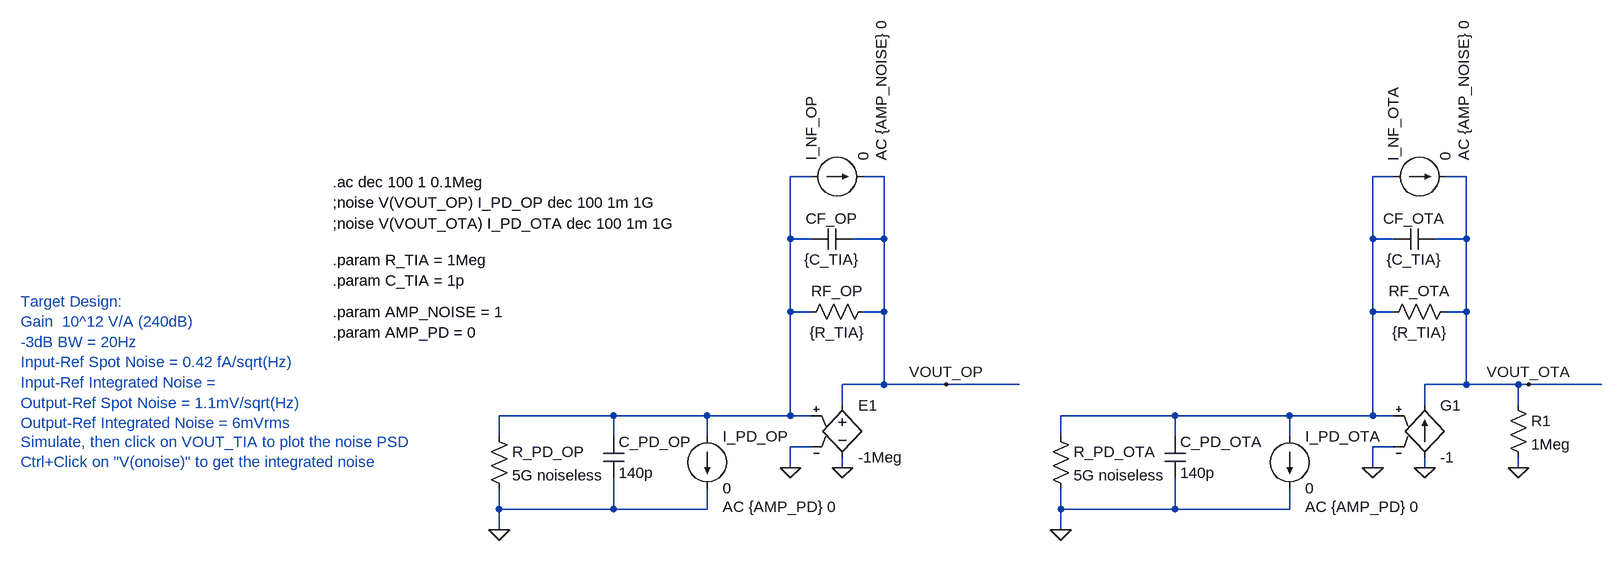
[diagram p0: schematic voltage_amp_vs_ota.asc]
voltage_amp_vs_ota.asc, the LTspice schematic file:
Version 4
SHEET 1 1156 836
WIRE -64 -224 -96 -224
WIRE 48 -224 16 -224
WIRE 832 -224 800 -224
WIRE 944 -224 912 -224
WIRE -96 -128 -96 -224
WIRE -64 -128 -96 -128
WIRE 48 -128 48 -224
WIRE 48 -128 0 -128
WIRE 800 -128 800 -224
WIRE 832 -128 800 -128
WIRE 944 -128 944 -224
WIRE 944 -128 896 -128
WIRE -96 -16 -96 -128
WIRE -64 -16 -96 -16
WIRE 48 -16 48 -128
WIRE 48 -16 16 -16
WIRE 800 -16 800 -128
WIRE 832 -16 800 -16
WIRE 944 -16 944 -128
WIRE 944 -16 912 -16
WIRE 48 96 48 -16
WIRE 48 96 -16 96
WIRE 144 96 48 96
WIRE 256 96 144 96
WIRE 944 96 944 -16
WIRE 944 96 880 96
WIRE 1024 96 944 96
WIRE 1040 96 1024 96
WIRE 1152 96 1040 96
WIRE -16 128 -16 96
WIRE 880 128 880 96
WIRE 1024 128 1024 96
WIRE -368 144 -544 144
WIRE -224 144 -368 144
WIRE -96 144 -96 -16
WIRE -96 144 -224 144
WIRE -64 144 -96 144
WIRE 496 144 320 144
WIRE 672 144 496 144
WIRE 800 144 800 -16
WIRE 800 144 672 144
WIRE 832 144 800 144
WIRE -544 176 -544 144
WIRE -368 176 -368 144
WIRE -224 176 -224 144
WIRE 320 176 320 144
WIRE 496 176 496 144
WIRE 672 176 672 144
WIRE -64 192 -96 192
WIRE 832 192 800 192
WIRE -96 224 -96 192
WIRE -16 224 -16 208
WIRE 800 224 800 192
WIRE 880 224 880 208
WIRE 1024 224 1024 208
WIRE -544 288 -544 256
WIRE -368 288 -368 240
WIRE -368 288 -544 288
WIRE -224 288 -224 256
WIRE -224 288 -368 288
WIRE 320 288 320 256
WIRE 496 288 496 240
WIRE 496 288 320 288
WIRE 672 288 672 256
WIRE 672 288 496 288
WIRE -544 320 -544 288
WIRE 320 320 320 288
FLAG -96 224 0
FLAG -544 320 0
FLAG 144 96 VOUT_OP
FLAG -16 224 0
FLAG 800 224 0
FLAG 320 320 0
FLAG 1040 96 VOUT_OTA
FLAG 880 224 0
FLAG 1024 224 0
SYMBOL cap -384 176 R0
SYMATTR InstName C_PD_OP
SYMATTR Value 140p
SYMBOL res -560 160 R0
SYMATTR InstName R_PD_OP
SYMATTR Value 5G noiseless
SYMBOL res 32 -32 R90
WINDOW 0 0 56 VBottom 2
WINDOW 3 32 56 VTop 2
SYMATTR InstName RF_OP
SYMATTR Value {R_TIA}
SYMBOL current -224 176 R0
WINDOW 123 24 108 Left 2
WINDOW 39 0 0 Left 0
SYMATTR InstName I_PD_OP
SYMATTR Value 0
SYMATTR Value2 AC {AMP_PD} 0
SYMBOL cap 0 -144 R90
WINDOW 0 0 32 VBottom 2
WINDOW 3 32 32 VTop 2
SYMATTR InstName CF_OP
SYMATTR Value {C_TIA}
SYMBOL e -16 112 R0
SYMATTR InstName E1
SYMATTR Value -1Meg
SYMBOL cap 480 176 R0
SYMATTR InstName C_PD_OTA
SYMATTR Value 140p
SYMBOL res 304 160 R0
SYMATTR InstName R_PD_OTA
SYMATTR Value 5G noiseless
SYMBOL res 928 -32 R90
WINDOW 0 0 56 VBottom 2
WINDOW 3 32 56 VTop 2
SYMATTR InstName RF_OTA
SYMATTR Value {R_TIA}
SYMBOL current 672 176 R0
WINDOW 123 24 108 Left 2
WINDOW 39 0 0 Left 0
SYMATTR InstName I_PD_OTA
SYMATTR Value 0
SYMATTR Value2 AC {AMP_PD} 0
SYMBOL cap 896 -144 R90
WINDOW 0 0 32 VBottom 2
WINDOW 3 32 32 VTop 2
SYMATTR InstName CF_OTA
SYMATTR Value {C_TIA}
SYMBOL g 880 112 R0
SYMATTR InstName G1
SYMATTR Value -1
SYMBOL res 1008 112 R0
SYMATTR InstName R1
SYMATTR Value 1Meg
SYMBOL current -64 -224 R270
WINDOW 123 24 108 Left 2
WINDOW 39 0 0 Left 0
SYMATTR InstName I_NF_OP
SYMATTR Value 0
SYMATTR Value2 AC {AMP_NOISE} 0
SYMBOL current 832 -224 R270
WINDOW 123 24 108 Left 2
WINDOW 39 0 0 Left 0
SYMATTR InstName I_NF_OTA
SYMATTR Value 0
SYMATTR Value2 AC {AMP_NOISE} 0
TEXT -800 -96 Left 2 !.param R_TIA = 1Meg
TEXT -800 -216 Left 2 !.ac dec 100 1 0.1Meg
TEXT -1280 -32 Left 2 ;Target Design:\nGain  10^12 V/A (240dB)\n-3dB BW = 20Hz\nInput-Ref Spot Noise = 0.42 fA/sqrt(Hz)\nInput-Ref Integrated Noise = \nOutput-Ref Spot Noise = 1.1mV/sqrt(Hz)\nOutput-Ref Integrated Noise = 6mVrms
TEXT -800 -184 Left 2 !;noise V(VOUT_OP) I_PD_OP dec 100 1m 1G
TEXT -1280 184 Left 2 ;Simulate, then click on VOUT_TIA to plot the noise PSD\nCtrl+Click on "V(onoise)" to get the integrated noise
TEXT -800 -64 Left 2 !.param C_TIA = 1p
TEXT -800 -152 Left 2 !;noise V(VOUT_OTA) I_PD_OTA dec 100 1m 1G
TEXT -800 -16 Left 2 !.param AMP_NOISE = 1
TEXT -800 16 Left 2 !.param AMP_PD = 0

The netlist it stands for:
* voltage_amp_vs_ota.asc
C_PD_OP N001 0 140p
R_PD_OP N001 0 5G noiseless
RF_OP VOUT_OP N001 {R_TIA}
I_PD_OP N001 0 0 AC {AMP_PD} 0
CF_OP VOUT_OP N001 {C_TIA}
E1 VOUT_OP 0 N001 0 -1Meg
C_PD_OTA N002 0 140p
R_PD_OTA N002 0 5G noiseless
RF_OTA VOUT_OTA N002 {R_TIA}
I_PD_OTA N002 0 0 AC {AMP_PD} 0
CF_OTA VOUT_OTA N002 {C_TIA}
G1 0 VOUT_OTA N002 0 -1
R1 VOUT_OTA 0 1Meg
I_NF_OP N001 VOUT_OP 0 AC {AMP_NOISE} 0
I_NF_OTA N002 VOUT_OTA 0 AC {AMP_NOISE} 0
.param R_TIA = 1Meg
.ac dec 100 1 0.1Meg
* Target Design:
* Gain  10^12 V/A (240dB)
* -3dB BW = 20Hz
* Input-Ref Spot Noise = 0.42 fA/sqrt(Hz)
* Input-Ref Integrated Noise =
* Output-Ref Spot Noise = 1.1mV/sqrt(Hz)
* Output-Ref Integrated Noise = 6mVrms
;noise V(VOUT_OP) I_PD_OP dec 100 1m 1G
* Simulate, then click on VOUT_TIA to plot the noise PSD
* Ctrl+Click on "V(onoise)" to get the integrated noise
.param C_TIA = 1p
;noise V(VOUT_OTA) I_PD_OTA dec 100 1m 1G
.param AMP_NOISE = 1
.param AMP_PD = 0
.backanno
.end

* Results of the author's LTspice run, read from the files saved beside the schematic
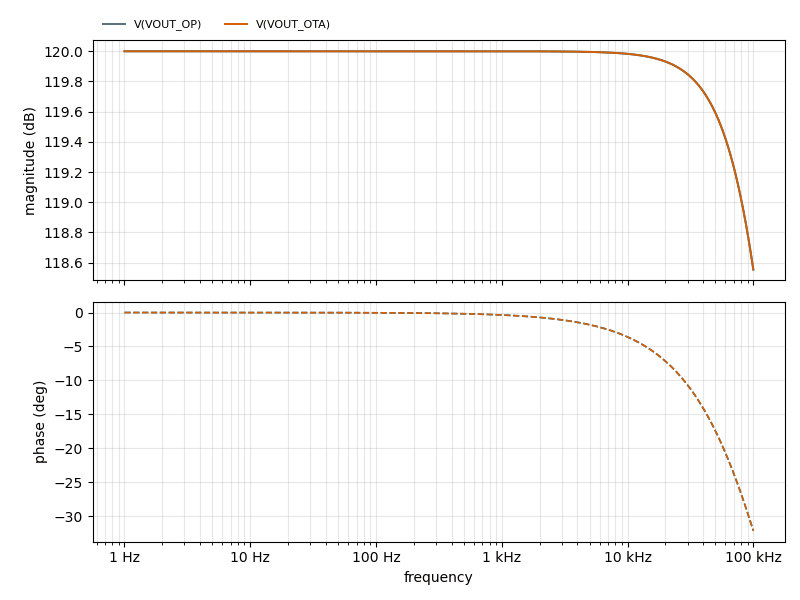
[diagram p1: AC Analysis of voltage_amp_vs_ota.asc, plotted from the saved traces]
* AC Analysis, 1 run:
*   V(VOUT_OP): 120.00 dB at 1 Hz, 118.55 dB at 100 kHz, peak 120.00 dB at 1 Hz
*   V(VOUT_OTA): 120.00 dB at 1 Hz, 118.55 dB at 100 kHz, peak 120.00 dB at 1 Hz